# EAGLE board aq_mx_v1-6-0a (EAGLE 9.6.2)
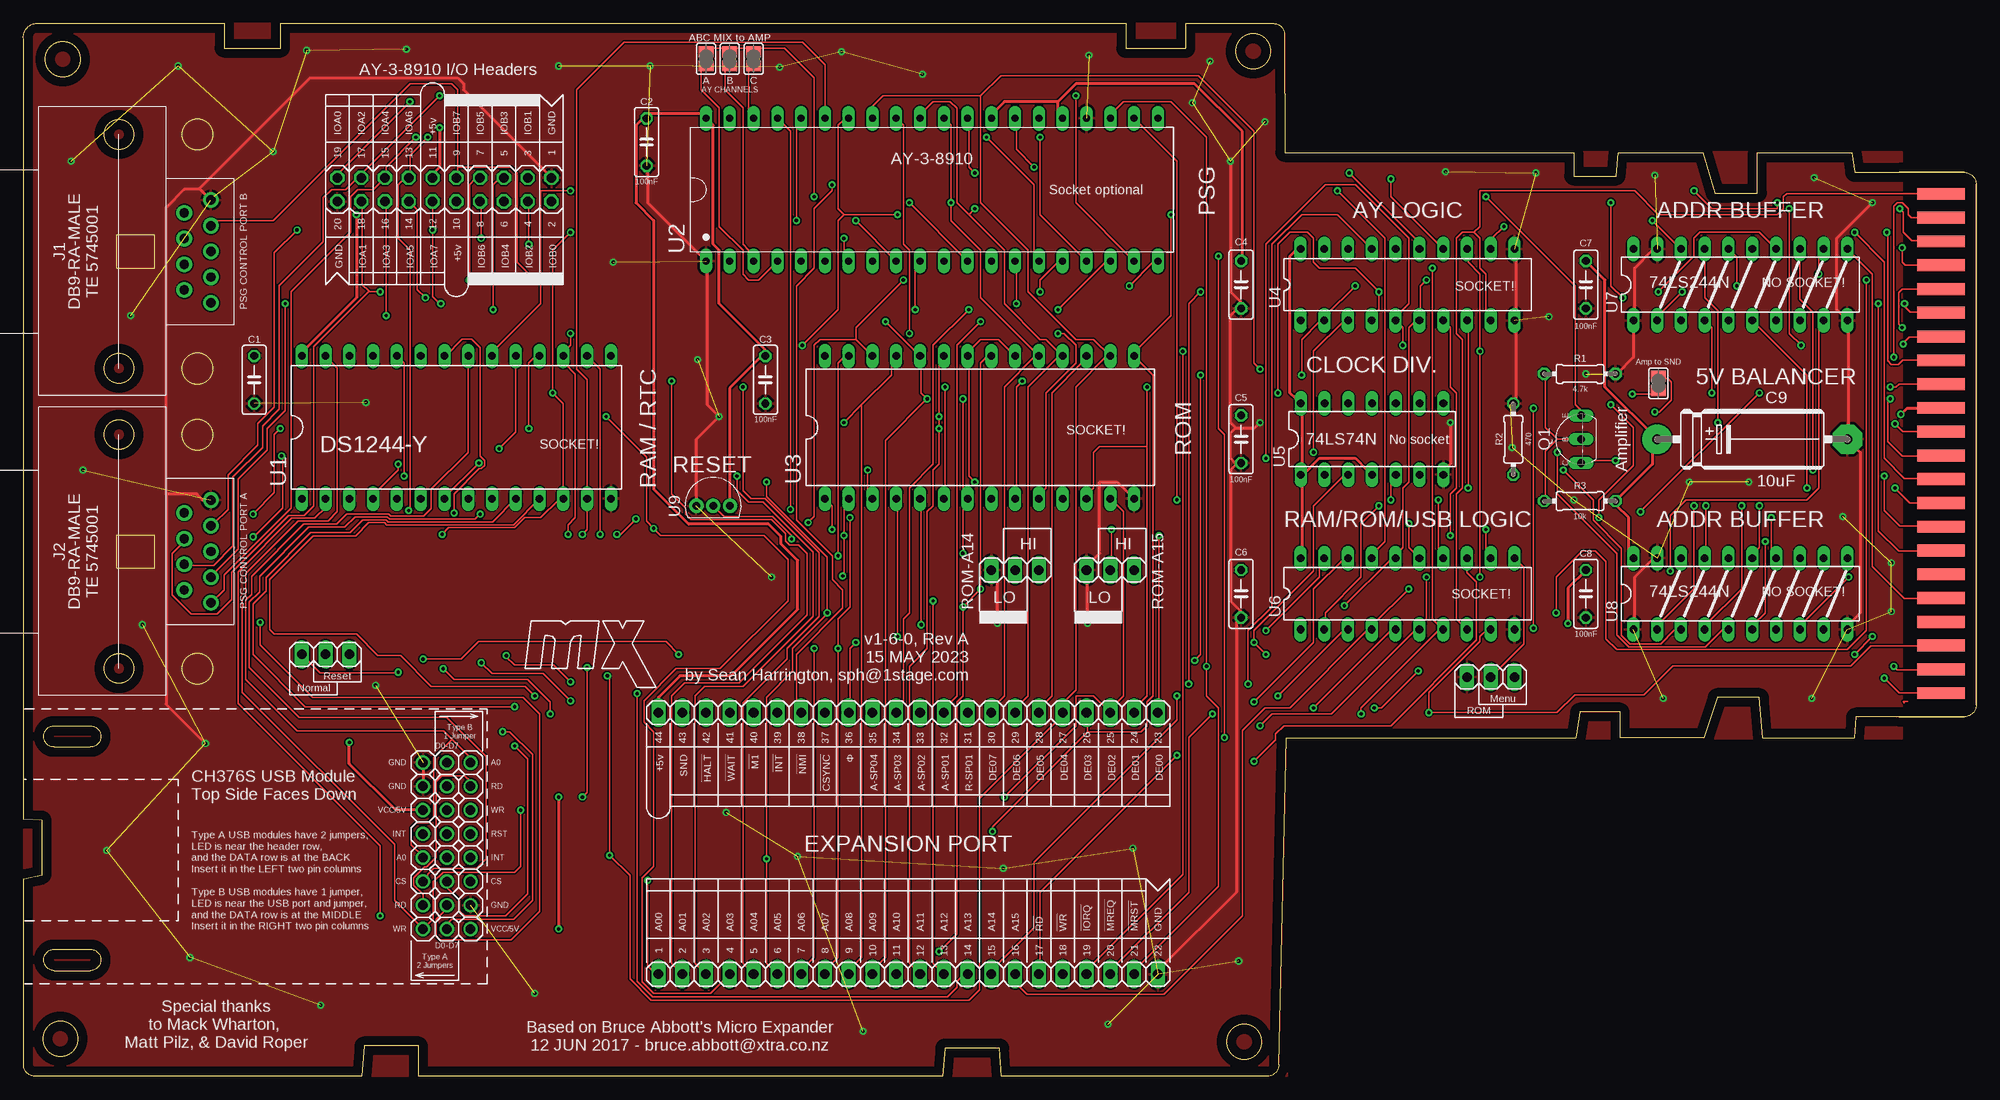
[diagram p1: board, top side]
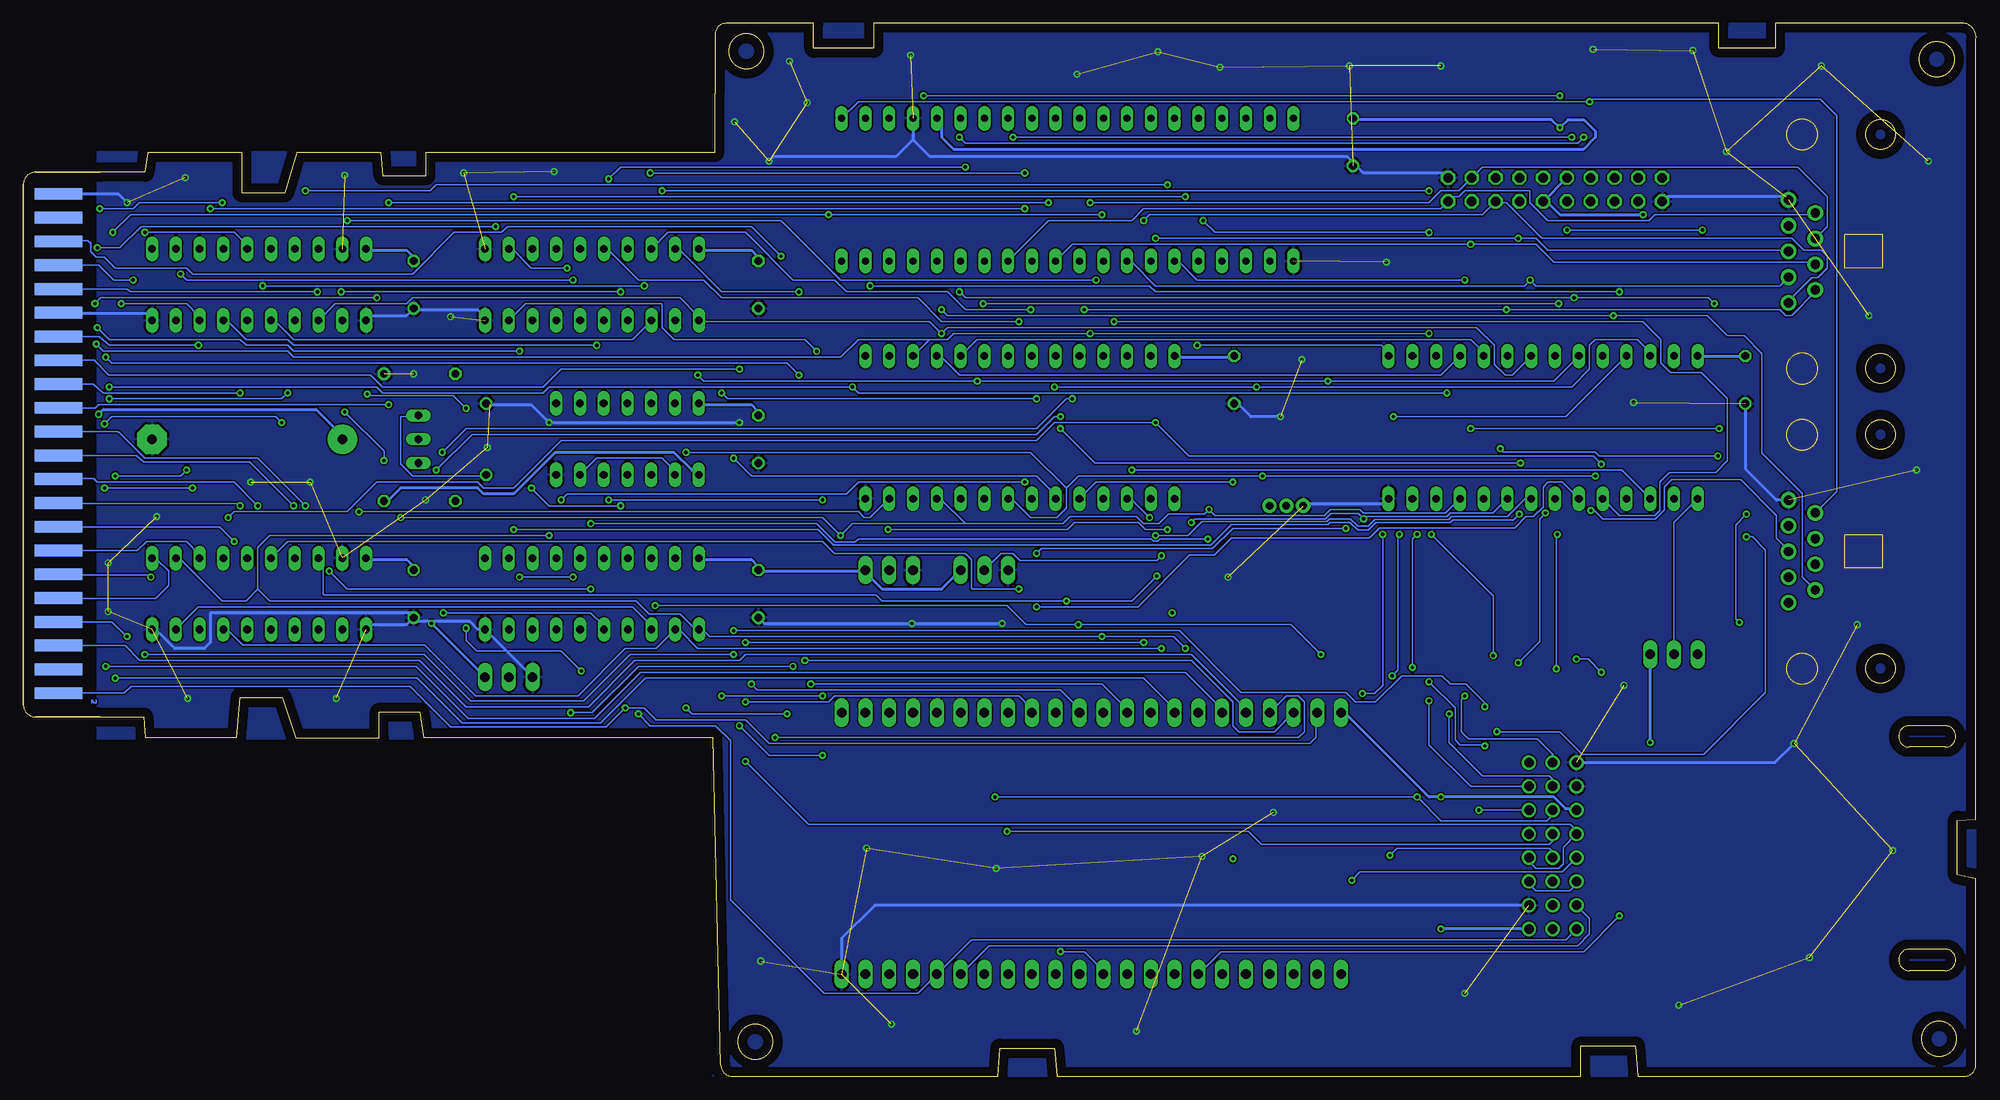
[diagram p2: board, bottom side, seen from below]

Size 208.57 x 112.5 mm. Coordinates in mm from the lower left corner, seen from the top.
Outline: 195.31,98.7 195.59,96.6 207.3,96.6 arc-90 208.57,95.33 208.57,39.67 arc-90 207.3,38.41 195.72,38.41 195.57,36.14 185.81,36.14 185.43,40.49 180.91,40.49 179.51,36.14 170.55,36.14 170.55,38.91 166.23,38.91 165.82,36.14 134.91,36.14 134.1,1.27 arc-90 132.83,0 104.46,0 104.28,3.02 98.44,3.02 98.16,0 42.2,0 42.2,3.25 36.38,3.25 36.13,0 1.28,0 arc-90 0.01,1.27 0.01,21.13 1.99,21.54 1.99,27.36 0.01,27.48 0.01,110.85 arc-90 1.28,112.5 21.42,112.5 21.42,109.86 27.47,109.86 27.47,112.5 117.77,112.5 117.77,109.83 124.17,109.83 124.17,112.5 133.44,112.5 arc-90 134.71,111.35 134.73,98.7 165.59,98.7 165.59,96.19 170.14,96.19 170.37,98.7 179.39,98.7 180.68,94.39 185.23,94.39 185.23,98.7 195.31,98.7
Outline: 3.31,35.18 7.12,35.18 arc180 7.12,37.47 3.31,37.47 arc180 3.31,35.18
Outline: 3.31,11.3 7.12,11.3 arc180 7.12,13.59 3.31,13.59 arc180 3.31,11.3
Outline: circle at 3.95,4.01 radius 1.86
Outline: circle at 4.2,108.66 radius 1.86
Outline: circle at 131.35,109.52 radius 1.86
Outline: circle at 130.39,3.71 radius 1.86
Outline: circle at 10.2,100.63 radius 1.57
Outline: circle at 10.2,75.64 radius 1.57
Outline: circle at 10.2,68.58 radius 1.57
Outline: circle at 10.2,43.59 radius 1.57
Copper layers (1*16): Top 0.035mm / dielectric 1.5mm / Bottom 0.035mm
Design rules "default": minimum track width 6mil, minimum drill 0.35mm, track to track 6mil, track to pad 6mil, pad to pad 6mil, via to via 6mil, smd to smd 6mil, copper to edge 40mil, drill to drill 6mil, minimum pad ring 10mil, minimum via ring 8mil, stop-mask expansion 4mil, vias tented up to drill 0mil, thermal gap 10mil
Net classes: 1 Power: width 0.305 mm, drill 0.102 mm, clearance 0.076 mm
tKeepout: area 26.7,45.7 to 79,58.4; area 202.7,38.1 to 208.3,96.5
bKeepout: area 202.7,38.1 to 208.3,96.5
Milling: area 16.9,99 to 20.2,102.3; area 16.9,74 to 20.2,77.3; area 16.9,66.9 to 20.2,70.2; area 16.9,41.9 to 20.2,45.2

## Footprints (pad centres in the part's own frame; a part is rotated, then mirrored left to right if it is on the bottom)
C050-025X075 = drill 0.813 octagon: 1 -2.54,0; 2 2.54,0
E22-6 = drill 1.016 pad 3.15: + -11.43,0 | drill 1.016 pad 3.15 octagon: - 8.89,0
DB9-MALE-RA = drill 1 pad 1.676: P$1 5.537,-9.83; P$2 2.794,-9.83; P$3 0.051,-9.83; P$4 -2.692,-9.83; P$5 -5.436,-9.83; P$6 4.166,-6.985; P$7 1.422,-6.985; P$8 -1.321,-6.985; P$9 -4.064,-6.985
1X03 = drill 1.016 long: 1 -2.54,0; 2 0,0; 3 2.54,0
2X10 = drill 1.016 octagon: 1 -11.43,-1.27; 2 -11.43,1.27; 3 -8.89,-1.27; 4 -8.89,1.27; 5 -6.35,-1.27; 6 -6.35,1.27; 7 -3.81,-1.27; 8 -3.81,1.27; 9 -1.27,-1.27; 10 -1.27,1.27; 11 1.27,-1.27; 12 1.27,1.27; 13 3.81,-1.27; 14 3.81,1.27; 15 6.35,-1.27; 16 6.35,1.27; 17 8.89,-1.27; 18 8.89,1.27; 19 11.43,-1.27; 20 11.43,1.27
1X22 = drill 1.016 long: 1 -26.67,0; 2 -24.13,0; 3 -21.59,0; 4 -19.05,0; 5 -16.51,0; 6 -13.97,0; 7 -11.43,0; 8 -8.89,0; 9 -6.35,0; 10 -3.81,0; 11 -1.27,0; 12 1.27,0; 13 3.81,0; 14 6.35,0; 15 8.89,0; 16 11.43,0; 17 13.97,0; 18 16.51,0; 19 19.05,0; 20 21.59,0; 21 24.13,0; 22 26.67,0
1X08 = drill 1.016: 1 -8.89,0; 2 -6.35,0; 3 -3.81,0; 4 -1.27,0; 5 1.27,0; 6 3.81,0; 7 6.35,0; 8 8.89,0
TO92-CBE = drill 0.813 long: B 0,0; C -2.54,0; E 2.54,0
0204/7 = drill 0.813 octagon: 1 -3.81,0; 2 3.81,0
SJ = smd 1.168 x 1.6: 1 -0.762,0; 2 0.762,0
DIL28-6 = drill 0.813 long: 1 -16.51,-7.62; 2 -13.97,-7.62; 3 -11.43,-7.62; 4 -8.89,-7.62; 5 -6.35,-7.62; 6 -3.81,-7.62; 7 -1.27,-7.62; 8 1.27,-7.62; 9 3.81,-7.62; 10 6.35,-7.62; 11 8.89,-7.62; 12 11.43,-7.62; 13 13.97,-7.62; 14 16.51,-7.62; 15 16.51,7.62; 16 13.97,7.62; 17 11.43,7.62; 18 8.89,7.62; 19 6.35,7.62; 20 3.81,7.62; 21 1.27,7.62; 22 -1.27,7.62; 23 -3.81,7.62; 24 -6.35,7.62; 25 -8.89,7.62; 26 -11.43,7.62; 27 -13.97,7.62; 28 -16.51,7.62
RAD38910-DIL40-6 = drill 0.743 pad 1.343 long: 1 -7.62,24.13; 2 -7.62,21.59; 3 -7.62,19.05; 4 -7.62,16.51; 5 -7.62,13.97; 6 -7.62,11.43; 7 -7.62,8.89; 8 -7.62,6.35; 9 -7.62,3.81; 10 -7.62,1.27; 11 -7.62,-1.27; 12 -7.62,-3.81; 13 -7.62,-6.35; 14 -7.62,-8.89; 15 -7.62,-11.43; 16 -7.62,-13.97; 17 -7.62,-16.51; 18 -7.62,-19.05; 19 -7.62,-21.59; 20 -7.62,-24.13; 21 7.62,-24.13; 22 7.62,-21.59; 23 7.62,-19.05; 24 7.62,-16.51; 25 7.62,-13.97; 26 7.62,-11.43; 27 7.62,-8.89; 28 7.62,-6.35; 29 7.62,-3.81; 30 7.62,-1.27; 31 7.62,1.27; 32 7.62,3.81; 33 7.62,6.35; 34 7.62,8.89; 35 7.62,11.43; 36 7.62,13.97; 37 7.62,16.51; 38 7.62,19.05; 39 7.62,21.59; 40 7.62,24.13
DIL20 = drill 0.813 long: 1 -11.43,-3.81; 2 -8.89,-3.81; 3 -6.35,-3.81; 4 -3.81,-3.81; 5 -1.27,-3.81; 6 1.27,-3.81; 7 3.81,-3.81; 8 6.35,-3.81; 9 8.89,-3.81; 10 11.43,-3.81; 11 11.43,3.81; 12 8.89,3.81; 13 6.35,3.81; 14 3.81,3.81; 15 1.27,3.81; 16 -1.27,3.81; 17 -3.81,3.81; 18 -6.35,3.81; 19 -8.89,3.81; 20 -11.43,3.81
DIL14 = drill 0.813 long: 1 -7.62,-3.81; 2 -5.08,-3.81; 3 -2.54,-3.81; 4 0,-3.81; 5 2.54,-3.81; 6 5.08,-3.81; 7 7.62,-3.81; 8 7.62,3.81; 9 5.08,3.81; 10 2.54,3.81; 11 0,3.81; 12 -2.54,3.81; 13 -5.08,3.81; 14 -7.62,3.81
TO-92 = drill 0.81 pad 1.51: 1 0,-1.8; 2 0,0; 3 0,1.8
AQ-CART-EDGE = smd 5.08 x 1.27: P$1 -1.905,-26.67; P$3 -1.905,-24.13; P$5 -1.905,-21.59; P$7 -1.905,-19.05; P$9 -1.905,-16.51; P$11 -1.905,-13.97; P$13 -1.905,-11.43; P$15 -1.905,-8.89; P$17 -1.905,-6.35; P$19 -1.905,-3.81; P$21 -1.905,-1.27; P$23 -1.905,1.27; P$25 -1.905,3.81; P$27 -1.905,6.35; P$29 -1.905,8.89; P$31 -1.905,11.43; P$33 -1.905,13.97; P$35 -1.905,16.51; P$37 -1.905,19.05; P$39 -1.905,21.59; P$41 -1.905,24.13; P$43 -1.905,26.67 | smd 5.08 x 1.27 bottom: P$2 -1.905,-26.67; P$4 -1.905,-24.13; P$6 -1.905,-21.59; P$8 -1.905,-19.05; P$10 -1.905,-16.51; P$12 -1.905,-13.97; P$14 -1.905,-11.43; P$16 -1.905,-8.89; P$18 -1.905,-6.35; P$20 -1.905,-3.81; P$22 -1.905,-1.27; P$24 -1.905,1.27; P$26 -1.905,3.81; P$28 -1.905,6.35; P$30 -1.905,8.89; P$32 -1.905,11.43; P$34 -1.905,13.97; P$36 -1.905,16.51; P$38 -1.905,19.05; P$40 -1.905,21.59; P$42 -1.905,24.13; P$44 -1.905,26.67

## Placement (x,y rotation side)
C1  100nF  [C050-025X075]  24.65,74.42 90 top
C2  100nF  [C050-025X075]  66.56,99.82 270 top
C3  100nF  [C050-025X075]  79.26,74.42 90 top
C4  100nF  [C050-025X075]  130.06,84.58 90 top
C5  100nF  [C050-025X075]  130.06,68.07 90 top
C6  100nF  [C050-025X075]  130.06,51.56 90 top
C7  100nF  [C050-025X075]  166.89,84.58 90 top
C8  100nF  [C050-025X075]  166.89,51.56 90 top
C9  10uF  [E22-6]  185.94,68.07 0 top
J1  DB9-MALE-RA  [DB9-MALE-RA]  10.2,88.09 90 top
J2  DB9-MALE-RA  [DB9-MALE-RA]  10.2,56.03 90 top
J3  RESET BEHV.  [1X03]  156.73,42.67 180 top
J4  [2X10]  44.97,94.74 180 top
J5  RTC Reset  [1X03]  32.27,45.09 180 top
J6  [1X22]  94.5,38.86 180 top
J7  [1X22]  94.5,10.92 0 top
J8  [1X03]  105.93,54.1 0 top
J9  [1X03]  116.09,54.1 0 top
JP1  [1X08]  42.68,24.64 270 top
JP2  [1X08]  45.22,24.64 270 top
JP3  [1X08]  47.76,24.64 270 top
LOGO  [AQUARIUS-LOGO-SMALL]  26.68,48.26 0 top
Q1  BC548  [TO92-CBE]  166.38,68.07 90 top
R1  4.7k  [0204/7]  166.25,75.06 0 top
R2  470  [0204/7]  159.14,68.07 90 top
R3  10k  [0204/7]  166.25,61.47 0 top
SJ1  [SJ]  72.91,108.71 90 top
SJ2  [SJ]  75.45,108.71 90 top
SJ3  [SJ]  77.99,108.71 90 top
SJ4  [SJ]  174.64,74.04 90 top
U1  CY62256LL-PC  [DIL28-6]  46.24,69.34 0 top
U2  AY-3-8910  [RAD38910-DIL40-6]  97.04,94.74 90 top
U3  27C512AP  [DIL28-6]  102.12,69.34 0 top
U4  GAL16V8  [DIL20]  147.84,84.58 0 top
U5  74LS74N  [DIL14]  144.05,68.1 0 top
U6  GAL16V8  [DIL20]  147.84,51.56 0 top
U7  74LS244N  [DIL20]  183.4,84.58 0 top
U8  74LS244N  [DIL20]  183.4,51.56 0 top
U9  DS1233  [TO-92]  73.67,60.96 270 top
XC1  AQ-CART-EDGE  [AQ-CART-EDGE]  206.74,67.61 0 top

## Tracks (layer width: path | path; a pad name or v marks a point on that pad's centre or on a via)
1-BC1  (via drill 0.35)
  Top 0.152: v141.62,96.52 148.6,89.53 148.6,88.9 U4.15 | v101.61,96.52 100.98,97.16 100.98,102.23 U2.29
  Bottom 0.152: v101.61,96.52 v141.62,96.52
1-IOA0  (via drill 0.35)
  Top 0.152: v41.29,104.14 33.67,96.52 J4.19
  Bottom 0.152: U2.21 119.39,104.14 v41.29,104.14 41.03,104.39 16.65,104.39 14.87,102.62 14.87,62.51 J2.P$6
1-IOA1  (via drill 0.35)
  Top 0.152: v118.12,84.45 120.66,87 U2.20 | 36.91,83.88 36.21,84.58 36.21,93.34 J4.18 | v38.11,83.82 36.97,83.82 36.91,83.88 | 36.91,83.88 31,77.98 31,60.96 29.98,59.94 28.33,59.94 22.24,53.85 22.24,50.93 20.71,49.4 17.92,49.4 15.89,51.44 15.89,55.88 17.16,57.15 J2.P$7
  Bottom 0.152: v118.12,84.45 88.28,84.45 87.64,83.82 v38.11,83.82
1-IOA2  (via drill 0.35)
  Top 0.152: U2.19 112.41,93.34 v112.41,104.78 | v44.46,104.78 36.21,96.52 J4.17 35.57,95.89 34.43,94.74 32.9,94.74 32.04,93.88 32.04,89.18 27.34,84.48 27.34,71.28 25.54,69.47 25.54,67.18 22.36,64.01 22.36,56.64 20.33,54.61 17.79,54.61 J2.P$8
  Bottom 0.152: v44.46,104.78 v112.41,104.78
1-IOA3  (via drill 0.35)
  Top 0.152: v110.5,81.92 115.58,87 U2.18 | v38.75,81.28 38.75,93.34 J4.16
  Bottom 0.152: v110.5,81.92 109.87,81.28 v38.75,81.28 28.71,81.28 26.55,79.12 24.78,79.12 22.9,77.24 22.9,66.57 18.58,62.26 18.58,53.37 J2.P$9
1-IOA4  (via drill 0.35)
  Top 0.152: U2.17 108.6,92.08 v108.6,100.33 | v41.92,100.33 38.75,97.16 38.75,96.52 J4.15 37.35,94.74 35.7,94.74 34.94,93.98 34.94,90.17 28.59,83.82 28.59,60.71 21.42,53.54 21.42,51.99 J2.P$5
  Bottom 0.152: v108.6,100.33 107.96,99.69 42.56,99.69 v41.92,100.33
1-IOA5  (via drill 0.35)
  Top 0.152: v108.6,83.82 108.6,85.09 110.5,87 U2.16 | v42.94,83.19 42.05,84.07 42.05,92.58 J4.14 | J2.P$4 20.03,53.42 22.94,56.33 22.94,63.82 26.05,66.93 26.05,69.22 27.95,71.12 v27.95,82.55
  Bottom 0.152: v108.6,83.82 107.96,83.19 v42.94,83.19 28.59,83.19 v27.95,82.55
1-IOA6  (via drill 0.35)
  Top 0.152: v102.88,100.33 107.96,95.25 107.96,87.63 U2.15 | v43.19,100.33 41.29,98.42 41.29,96.52 J4.13 40.65,95.89 40.02,95.25 40.02,89.53 41.29,88.27 41.29,60.58 v41.16,60.45
  Bottom 0.152: v43.19,100.33 v102.88,100.33 | v41.16,60.45 40.78,60.45 39.89,59.56 34.25,59.56 33.29,60.53 33.29,62.99 32.52,63.75 25.16,63.75 21.35,59.94 21.35,57.53 20.33,56.52 J2.P$3
1-IOA7  (via drill 0.35)
  Top 0.152: v106.06,82.55 106.06,87 U2.14 | v44.59,82.55 44.46,82.55 43.7,83.31 v43.7,90.42 J4.12 | J2.P$2 20.33,59.05 21.86,60.58 21.86,64.26 25.03,67.44 25.03,69.72 26.81,71.5 26.81,88.01 v29.22,90.42
  Bottom 0.152: v44.59,82.55 v106.06,82.55 | v43.7,90.42 v29.22,90.42
1-IOB0
  Bottom 0.152: U2.13 99.07,91.44 90.18,91.44 88.91,92.71 57.16,92.71 J4.2 55.89,93.98 55.26,93.98 54.62,94.61 47.64,94.61 47.64,93.34 45.73,91.44 34.94,91.44 34.3,92.08 17.79,92.08 J1.P$6
1-IOB1  (via drill 0.35)
  Top 0.152: v94.63,93.34 U2.12
  Bottom 0.152: v94.63,93.34 58.43,93.34 57.16,94.61 55.26,94.61 J4.3 52.72,97.16 19.06,97.16 15.89,93.98 15.89,90.81 J1.P$7
1-IOB2  (via drill 0.35)
  Top 0.152: v53.99,88.9 53.99,93.34 J4.4
  Bottom 0.152: U2.11 96.53,88.9 v53.99,88.9 47,88.9 45.1,87 17.79,87 J1.P$8
1-IOB3  (via drill 0.35)
  Top 0.152: v95.26,81.92 95.26,87 U2.10 | v50.18,81.92 50.18,95.25 50.81,95.89 J4.5
  Bottom 0.152: v95.26,81.92 v50.18,81.92 20.97,81.92 20.33,81.28 19.7,81.28 17.16,83.82 J1.P$9
1-IOB4  (via drill 0.35)
  Top 0.152: v88.91,91.44 U2.9
  Bottom 0.152: v88.91,91.44 88.28,92.08 52.72,92.08 J4.6 50.81,93.34 50.18,93.34 46.37,89.53 19.7,89.53 18.43,88.27 16.54,88.27 15.89,87.61 15.89,86.36 16.9,85.34 17.54,85.34 19.7,83.19 J1.P$5
1-IOB5  (via drill 0.35)
  Top 0.152: v47.64,85.09 47.64,95.25 48.27,95.89 J4.7
  Bottom 0.152: J1.P$4 20.97,84.45 47,84.45 v47.64,85.09 48.27,84.45 87.64,84.45 90.18,87 U2.8
1-IOB6  (via drill 0.35)
  Top 0.152: v87.64,89.53 87.64,87.63 U2.7 | v48.91,89.53 48.91,93.34 J4.8
  Bottom 0.152: v87.64,89.53 v48.91,89.53 47,89.53 45.73,88.27 20.33,88.27 J1.P$3
1-IOB7  (via drill 0.35)
  Top 0.152: v54.62,85.09 52.72,87 52.72,96.52 52.08,97.16 46.37,97.16 | 46.37,97.16 46.37,96.52 J4.9 | J1.P$2 20.33,91.44 26.68,91.44 41.29,106.05 45.73,106.05 46.37,105.41 46.37,97.16
  Bottom 0.152: v54.62,85.09 83.2,85.09 85.1,87 U2.6
!CH376  (via drill 0.35)
  Top 0.152: v156.22,58.42 156.22,55.88 U6.12 | JP1.6 43.19,20.95 43.19,21.59 43.83,22.23 48.4,22.23 49.41,23.24 49.41,34.16 45.22,38.35 29.48,38.35 24.14,43.69 24.14,50.67 25.22,51.75 25.22,53.4 30.49,58.67 34.32,58.67 35.42,59.77 38.87,59.77 39.1,59.54 48.25,59.54 v48.78,60.07
  Bottom 0.152: v156.22,58.42 123.71,58.42 122.06,56.77 81.7,56.77 79.52,58.95 69.23,58.95 69,59.18 66.86,59.18 66.05,58.37 64.91,58.37 64.1,59.18 56.15,59.18 55.89,59.44 49.41,59.44 v48.78,60.07 | 42.56,20.95 JP1.6 42.68,20.57 43.42,19.84 47.03,19.84 47.76,20.57 JP3.6
!CSYNC  (via drill 0.35)
  Top 0.152: v198.77,42.55 200.37,40.95 XC1.P$1
  Bottom 0.152: v198.77,42.55 166.51,42.55 161.71,37.75 146.92,37.75 142.12,42.55 88.91,42.55 85.74,39.37 J6.15
!HALT  (via drill 0.35)
  Top 0.152: v125.11,44.45 125.74,45.09 v125.74,74.93 | v199.78,76.83 199.78,92.96 200.16,93.34 200.66,93.34 201.31,92.7 201.31,92.08 201.64,91.75 XC1.P$41
  Bottom 0.152: J6.20 74.94,36.83 78.75,36.83 79.39,37.47 79.39,40.01 83.83,44.45 v125.11,44.45 | v125.74,74.93 127.01,76.2 199.15,76.2 v199.78,76.83
!INT  (via drill 0.35)
  Top 0.152: XC1.P$3 204.79,43.43 200.16,43.43 v199.78,43.81
  Bottom 0.152: v199.78,43.81 166.64,43.81 161.05,38.23 147.59,38.23 142.63,43.18 84.47,43.18 80.66,39.37 J6.17
!IORQ  (via drill 0.35)
  Top 0.152: U6.8 153.05,48.9 153.05,62.23 153.68,62.87 153.68,78.74 153.05,79.38 153.05,89.53 153.68,90.17 154.95,90.17 | U4.9 156.22,81.28 156.22,85.72 155.59,86.36 155.59,89.28 155.59,89.53 154.95,90.17 | v123.84,77.47 123.84,21.59 113.68,11.43 J7.19 | XC1.P$43 188.33,94.28 187.97,93.98 187.97,92.71 187.34,92.08 174.64,92.08 172.1,94.61 155.59,94.61 155.59,90.81 154.95,90.17
  Bottom 0.152: v123.84,77.47 125.11,78.74 139.08,78.74 140.35,80.01 140.35,82.55 154.95,82.55 U4.9
!M1
  Bottom 0.152: J6.18 78.12,39.37 83.83,45.09 131.46,45.09 132.09,44.45 143.27,44.45 148.22,39.5 161.3,39.5 166.25,44.45 196.14,44.45 197.72,46.02 XC1.P$6
!MREQ  (via drill 0.35)
  Top 0.152: v137.81,39.37 146.06,47.62 U6.5 | v127.01,38.73 124.47,36.2 124.47,19.68 116.22,11.43 J7.20 | v196.86,85.09 196.86,47.62 194.83,45.59 170.19,45.59 169.05,46.74 169.05,54.99 167.91,56.13 166.51,56.13 163.71,53.34 v163.71,49.53
  Bottom 0.152: v137.81,39.37 137.17,38.73 v127.01,38.73 | v196.86,85.09 198.94,85.09 200.51,86.67 XC1.P$38 | v163.71,49.53 147.97,49.53 146.7,48.26 U6.5
!MRST  (via drill 0.35)
  Top 0.152: U6.9 156.35,47.75 155.59,46.99 155.59,46.48 150.13,41.02 v150.13,38.86 163.8,38.86 165.7,40.77 173.1,40.77 176.16,43.83 195.19,43.83 197.34,45.97 204.78,45.97 XC1.P$5 | U2.23 116.22,102.87 117.49,104.14 122.57,104.14 126.38,100.33 v126.38,43.81 126.38,40.64 127.65,39.37 127.65,20.32 118.76,11.43 J7.21
  Bottom 0.152: v126.38,43.81 142.89,43.81 147.84,38.86 v150.13,38.86
!NMI  (via drill 0.35)
  Top 0.152: v86.37,95.25 86.37,94.61 84.47,92.71 84.47,86.36 82.56,84.45 82.56,59.44 86.4,55.6 86.4,53.09 87.51,51.97 87.51,50.04 82.56,45.09 82.56,39.37 J6.16 | v178.45,94.61 180.35,92.71 187.34,92.71 v187.34,93.34 | v200.42,92.71 200.8,92.33 200.8,90.17 201.69,89.28 204.76,89.28 XC1.P$39
  Bottom 0.152: v86.37,95.25 164.48,95.25 165.11,94.61 v178.45,94.61 | v187.34,93.34 196.23,93.34 196.86,92.71 v200.42,92.71
!PRST  (via drill 0.35)
  Top 0.152: U6.13 154.19,53.85 155.21,52.83 155.21,46.61 146.06,37.47 134.63,37.47 133.74,36.58 133.74,35.94 v131.46,33.66
  Bottom 0.152: v131.46,33.66 124.73,26.92 43.32,26.92 42.68,26.29 JP1.4 44.11,24.49 44.11,22.7 44.56,22.25 47.03,22.25 47.76,22.98 JP3.5
!RD  (via drill 0.35)
  Top 0.152: v149.87,53.34 149.87,48.9 149.24,48.26 U6.6 148.6,47.62 139.71,38.73 133.36,38.73 v132.09,37.47 | v155.59,53.34 v155.59,77.47 155.59,85.72 154.32,87 154.32,88.27 U4.13 | XC1.P$35 200.67,84.12 200.29,83.74 200.29,80.39 v200.67,80.01 | v123.2,34.29 108.6,19.68 108.6,11.43 J7.17 | JP1.7 42.68,19.43 41.69,20.42 41.69,21.24 42.83,22.38 43.09,22.38 44.11,23.39 44.11,31.52 44.69,32.11 47.15,32.11 47.76,31.5 JP3.2 | U1.22 45.08,76.96 46.89,78.77 47.88,78.77 48.78,77.86 48.78,66.26 49.26,65.78 49.26,65.28 48.9,64.92 48.68,64.92 45.99,62.23 v45.99,60.2 | v58.43,40.13 55.51,43.05 50.05,43.05 v48.91,44.2
  Bottom 0.152: v155.59,53.34 v149.87,53.34 | v200.67,80.01 199.4,78.74 185.43,78.74 184.8,78.11 180.35,78.11 179.72,77.47 v155.59,77.47 | J7.17 105.42,13.97 42.56,13.97 41.29,15.24 41.29,16.89 JP1.7 | v132.09,37.47 128.92,34.29 v123.2,34.29 | JP3.2 53.99,30.99 58.43,35.43 v58.43,40.13 | v48.91,44.2 46.62,46.48 46.62,59.56 v45.99,60.2
!WAIT  (via drill 0.35)
  Top 0.152: v128.28,36.2 128.28,68.58 127.65,69.22 v127.65,87.63
  Bottom 0.152: J6.19 73.67,40.64 72.4,40.64 71.77,40.01 71.77,36.83 72.4,36.2 v128.28,36.2 | v127.65,87.63 130.82,90.81 156.86,90.81 157.49,90.17 162.57,90.17 167.02,85.72 190.51,85.72 191.15,86.36 198.77,86.36 199.94,87.53 200.8,87.53 201.41,88.14 201.41,89 201.69,89.28 204.76,89.28 XC1.P$40
!WR  (via drill 0.35)
  Top 0.152: v150.51,86.36 150.51,48.9 U6.7 151.14,47.62 142.89,39.37 v142.89,38.73 | v200.67,88.52 200.67,87 201.03,86.67 XC1.P$37 | v158.13,90.81 156.86,89.53 156.86,88.9 U4.12 | U1.27 33.54,75.69 33.54,60.33 32.55,59.33 29.35,59.33 23.74,53.72 23.74,51.36 23.38,51 23.38,41.02 39.64,24.77 39.64,18.8 JP1.8 43.78,16.84 43.78,20.78 44.81,21.82 52.49,21.82 53.1,22.43 v53.1,28.45
  Bottom 0.152: v150.51,86.36 154.32,86.36 156.22,88.27 U4.12 | v200.67,88.52 198.26,88.52 195.97,90.81 v158.13,90.81 | JP1.8 43.83,14.61 107.33,14.61 J7.18 113.04,8.89 123.07,8.89 133.04,18.86 133.04,35.88 134.63,37.47 141.62,37.47 v142.89,38.73 | v53.1,28.45 JP3.3
A
  Top 0.152: U2.4 78.5,85.09 77.48,85.09 76.85,85.72 76.85,88.27 74.31,90.81 74.31,103.5 72.4,105.41 72.4,107.95 SJ1.1
A00  (via drill 0.35)
  Top 0.152: v110.5,79.38 111.14,79.38 112.41,78.11 112.41,76.2 109.23,73.03 109.23,62.87 108.6,62.23 U3.10 | U1.21 47.51,66.67 43.57,62.74 43.57,60.69 42.72,59.84 39.23,59.84 39,60.07 34.53,60.07 33.49,59.03 29.96,59.03 24.36,53.43 24.36,51.47 23.76,50.88 23.76,42.42 29.25,36.93 44.87,36.93 45.79,36.01 | J7.1 67.58,10.92 66.69,11.81 v66.69,20.95 | JP1.5 42.68,23.49 41.44,24.74 41.44,26.57 41.94,27.08 43.22,27.08 43.8,27.66 43.8,34.02 45.79,36.01 | JP3.1 47.76,34.04 45.79,36.01
  Bottom 0.152: U7.3 175.27,82.55 167.65,82.55 167.02,83.19 138.44,83.19 136.54,81.28 U4.1 135.9,80.64 111.77,80.64 v110.5,79.38 109.87,80.01 53.35,80.01 51.45,78.11 51.45,76.07 50.3,74.93 49.54,74.93 U1.21 | v66.69,20.95 65.8,21.84 44.21,21.84 JP1.5
A01  (via drill 0.35)
  Top 0.152: v106.69,74.3 106.06,73.66 106.06,62.23 U3.9 | v136.54,74.93 136.54,78.74 138.44,80.64 U4.2 139.08,81.28 v142.25,84.45 | U7.16 183.02,87.5 v183.02,84.45 | J7.2 69.23,12.06 69.23,40.64 70.62,42.04 76.47,42.04 83.7,49.28 83.7,55.88 82.82,56.77 81.83,56.77 81.42,57.18 81.42,57.99 79.9,59.51 71.31,59.51 70.75,60.07 70.75,60.71 69.23,62.23 v69.23,74.3
  Bottom 0.152: U1.23 45.1,74.3 v69.23,74.3 v106.69,74.3 135.9,74.3 v136.54,74.93 | v142.25,84.45 v183.02,84.45
A02  (via drill 0.35)
  Top 0.152: U1.24 40.65,76.2 v40.65,64.14 | J7.3 71.77,12.06 71.77,40.64 72.78,41.66 76.85,41.66 84.34,49.15 84.34,56.01 78.98,61.37 77.46,61.37 76.21,62.61 v76.21,64.14 | v137.81,66.67 137.81,77.47 140.98,80.64 U4.3
  Bottom 0.152: U4.3 143.52,78.74 179.72,78.74 181.62,80.64 U7.5 | v40.65,64.14 v76.21,64.14 95.9,64.14 97.17,62.87 | 97.17,62.87 97.17,60.71 98.18,59.69 100.98,59.69 102.88,61.59 U3.8 | v137.81,66.67 100.98,66.67 97.17,62.87
A03  (via drill 0.35)
  Top 0.152: v174.64,83.82 178.45,87.63 178.45,89.53 179.08,90.17 185.43,90.17 U7.14 | U4.4 144.16,81.28 144.79,81.92 v144.79,83.82 142.25,86.36 138.44,86.36 137.81,87 137.81,89.53 137.17,90.17 135.27,90.17 134,88.9 v134,73.03 | v62.24,70.48 66.56,66.17 66.56,59.31 v67.32,58.55 68.08,57.78 79.13,57.78 81.67,55.24 81.67,50.8 74.43,43.56 69.73,43.56 66.31,40.13 66.31,37.85 67.32,36.83 67.32,22.45 66.08,21.21 66.08,10.13 67.32,8.89 73.42,8.89 J7.4 | v100.34,55.88 100.34,61.59 U3.7 100.34,62.23 v100.34,72.39
  Bottom 0.152: v174.64,83.82 v144.79,83.82 | U1.25 43.83,70.48 v62.24,70.48 | v100.34,55.88 99.83,56.39 81.55,56.39 79.39,58.55 v67.32,58.55 | v134,73.03 133.36,72.39 v100.34,72.39
A04  (via drill 0.35)
  Top 0.152: v147.33,78.11 147.33,80.01 U4.5 146.7,81.28 147.97,82.55 147.97,89.53 142.25,95.25 139.08,95.25 132.73,88.9 v132.73,66.04 | v98.44,73.66 98.44,62.23 U3.6 | J7.5 76.85,12.06 76.85,39.88 81.55,44.58 81.55,45.72 84.97,49.15 84.97,55.96 79.21,61.72 77.74,61.72 76.85,62.61 v76.85,73.66
  Bottom 0.152: v147.33,78.11 179.72,78.11 180.35,78.74 184.8,78.74 186.7,80.64 U7.7 | v98.44,73.66 v76.85,73.66 43.19,73.66 41.29,75.56 41.29,78.11 40.65,78.74 36.21,78.74 34.94,77.47 U1.26 | v132.73,66.04 130.82,64.14 100.34,64.14 98.44,62.23 U3.6
A05  (via drill 0.35)
  Top 0.152: v191.78,85.72 191.78,88.27 U7.12 | v149.87,85.09 149.24,84.45 149.24,81.28 U4.6 148.6,80.64 147.97,80.01 147.97,63.5 147.33,62.87 147.33,56.52 146.7,55.88 U6.16 146.06,55.24 v141.11,50.29 | J7.6 79.39,12.06 v79.39,23.24 79.39,40.51 82.18,43.31 82.18,45.72 85.86,49.4 v85.86,49.53 85.86,55.5 79.39,61.98 v79.39,63.5 | v95.9,48.26 95.9,61.59 U3.5 | J5.3 31.69,43.13 39.97,43.13 v40.02,43.18 | v69.99,45.09 68.62,46.45 48.62,46.45 46.75,44.58 v42.68,44.58
  Bottom 0.152: v191.78,85.72 191.15,85.09 v149.87,85.09 | v79.39,63.5 93.99,63.5 U3.5 | v141.11,50.29 103.52,50.29 101.48,48.26 v95.9,48.26 73.16,48.26 v69.99,45.09 | v40.02,43.18 41.41,44.58 v42.68,44.58
A06  (via drill 0.35)
  Top 0.152: v93.36,46.99 93.36,61.59 U3.4 | U4.7 152.41,80.01 152.41,73.66 153.05,73.03 153.05,62.87 152.41,62.23 v152.41,57.78 | v84.47,45.72 84.47,12.7 83.2,11.43 J7.7 | v38.11,17.14 38.11,24.64 22.92,39.83 22.92,53.9 28.66,59.64 31.13,59.64 32.27,60.78 U1.2
  Bottom 0.152: v38.11,17.14 41.92,13.34 80.66,13.34 J7.7 | U8.12 191.78,55.24 187.34,50.8 184.8,50.8 183.53,52.07 | v152.41,57.78 182.26,57.78 183.53,56.52 183.53,52.07 | v84.47,45.72 85.74,46.99 v93.36,46.99 135.27,46.99 135.9,47.62 U6.1 136.79,47.75 138.44,49.4 141.74,49.4 143.14,50.8 182.26,50.8 183.53,52.07
A07  (via drill 0.35)
  Top 0.152: v154.32,62.87 154.32,80.64 U4.8 | v144.79,60.96 142.89,59.05 142.89,53.34 139.08,49.53 139.08,48.26 U6.2 | v90.18,64.77 90.18,62.23 U3.3 | v88.28,59.69 88.28,50.16 87.01,48.9 v87.01,45.72 87.01,12.7 85.74,11.43 J7.8
  Bottom 0.152: U8.7 186.7,47.62 185.15,46.08 165.72,46.08 160.29,40.64 149.34,40.64 144.28,45.7 140.99,45.7 138.95,47.74 U6.2 138.44,47.62 136.54,45.72 v87.01,45.72 | v154.32,62.87 152.41,60.96 v144.79,60.96 | v88.28,59.69 90.18,61.59 U3.3 | U1.3 37.86,64.77 v90.18,64.77
A08  (via drill 0.35)
  Top 0.152: v40.02,65.41 40.02,64.77 37.48,62.23 U1.4 | 89.55,71.75 92.72,74.93 92.72,76.83 U3.25 | 89.55,71.75 v87.64,69.85 | v186.7,59.69 186.7,55.88 U8.14 | 89.55,71.75 89.55,12.7 88.28,11.43 J7.9
  Bottom 0.152: v40.02,65.41 40.91,66.29 84.09,66.29 v87.64,69.85 98.44,69.85 100.34,67.94 151.14,67.94 156.22,62.87 159.4,62.87 160.03,63.5 170.83,63.5 174,60.33 186.07,60.33 v186.7,59.69
A09  (via drill 0.35)
  Top 0.152: v92.09,80.64 U3.24 95.9,76.83 95.9,73.03 v96.53,72.39 92.09,67.94 92.09,12.7 90.82,11.43 J7.10 | U8.5 181.51,47.75 179.65,45.9 171.48,45.9 170.19,47.18 170.19,55.88 163.84,62.23 v163.84,66.67
  Bottom 0.152: U1.5 38.11,59.94 34.3,59.94 33.79,60.45 33.79,63.5 32.78,64.52 27.82,64.52 26.55,65.79 26.55,72.39 29.35,75.18 32.65,75.18 33.67,76.2 33.67,78.74 35.57,80.64 v92.09,80.64 | v163.84,66.67 161.3,69.22 100.34,69.22 97.17,72.39 v96.53,72.39
A10  (via drill 0.35)
  Top 0.152: U3.21 102.88,76.83 102.25,76.2 v102.25,52.07 v100.34,50.16 100.34,40.64 99.71,40.01 99.71,15.24 v97.8,13.34
  Bottom 0.152: v100.34,50.16 89.55,50.16 84.01,55.7 81.37,55.7 79.54,57.53 64.78,57.53 63.74,58.57 49.29,58.57 48.07,59.79 47.27,59.79 46.24,60.82 46.24,62.99 45.73,63.5 44.21,63.5 U1.6 | U8.16 180.35,57.15 123.2,57.15 121.93,55.88 107.96,55.88 107.33,55.24 107.33,52.07 v102.25,52.07 | v97.8,13.34 95.26,13.34 93.36,11.43 J7.11
A11  (via drill 0.35)
  Top 0.152: v48.65,65.53 45.01,61.89 U1.7 | U3.23 97.8,76.83 v97.8,70.48 v97.8,69.22 97.8,65.41 97.17,64.77 97.17,60.96 96.53,60.33 96.53,45.72 94.63,43.81 94.63,12.06 J7.12 | U8.3 176.54,47.62 176.3,47.62 174.88,46.2 171.6,46.2 170.7,47.1 170.7,56.42 167.68,59.44 167.68,61.57 v164.48,64.77
  Bottom 0.152: v97.8,69.22 94.12,65.53 v48.65,65.53 | v164.48,64.77 160.67,68.58 100.34,68.58 98.44,70.48 v97.8,70.48
A12  (via drill 0.35)
  Top 0.152: U3.2 87.64,61.59 v87.64,57.78 87.64,53.59 v87.51,53.47 | J7.13 97.17,12.06 v97.17,50.8
  Bottom 0.152: v87.51,53.47 90.18,50.8 v97.17,50.8 116.85,50.8 117.49,51.44 176.54,51.44 176.54,55.24 U8.18 | U1.8 48.13,61.72 50.06,59.79 56.04,59.79 56.32,59.51 64.2,59.51 64.91,58.8 66.05,58.8 66.81,59.56 69.05,59.56 69.35,59.26 82.69,59.26 84.16,57.78 v87.64,57.78
A13  (via drill 0.35)
  Top 0.152: v83.83,59.18 84.47,59.82 84.47,78.11 85.1,78.74 88.91,78.74 | 88.91,78.74 U3.26 | v174,91.44 U7.18 | v93.99,85.09 88.91,80.01 88.91,78.74 | v65.54,40.89 65.54,10.16 67.19,8.51 98.69,8.51 99.71,9.53 99.71,10.16 100.34,10.79 J7.14 | v65.42,59.56 63.77,57.91 v63.38,57.91
  Bottom 0.152: v83.83,59.18 83.45,59.56 69.48,59.56 68.92,60.12 65.98,60.12 v65.42,59.56 65.16,59.82 56.53,59.82 56.17,60.17 51.6,60.17 U1.9 | v174,91.44 127.65,91.44 121.3,85.09 v93.99,85.09 | v63.38,57.91 63.38,41.78 64.27,40.89 v65.54,40.89
A14  (via drill 0.35)
  Top 0.152: v123.2,40.64 123.2,38.1 107.96,22.86 107.96,15.88 103.52,11.43 J7.15 | v134,40.64 140.98,47.62 U6.3
  Bottom 0.152: U8.9 189.88,50.16 143.52,50.16 141.62,48.26 U6.3 | v134,40.64 v123.2,40.64
A15  (via drill 0.35)
  Top 0.152: J7.16 105.93,10.03 107.2,8.76 121.8,8.76 130.19,17.14 130.19,36.96 132.6,39.37 135.27,39.37 143.52,47.62 U6.4 144.16,48.26 v147.97,52.07 | U7.9 191.78,80.64 191.78,62.87 190.51,61.59 177.56,61.59 175.91,59.94 v175.91,53.98
  Bottom 0.152: v175.91,53.98 174,52.07 v147.97,52.07
A-SP01  (via drill 0.35)
  Top 0.152: v102.25,80.64 99.71,78.11 99.71,40.64 98.44,39.37 J6.10
  Bottom 0.152: v102.25,80.64 110.5,80.64 113.04,83.19 134,83.19 135.9,85.09 142.89,85.09 146.06,88.27 U4.16
A-SP02  (via drill 0.35)
  Top 0.152: U4.17 140.35,92.08 136.54,92.08 133.36,88.9 133.36,50.16 130.82,47.62 v130.82,41.91
  Bottom 0.152: v130.82,41.91 130.19,41.27 97.8,41.27 95.9,39.37 J6.11
A-SP03  (via drill 0.35)
  Top 0.152: v100.98,81.92 97.17,78.11 97.17,65.41 94.63,62.87 94.63,49.53 93.99,48.9 93.99,40.01 93.36,39.37 J6.12
  Bottom 0.152: U4.18 139.71,90.17 131.46,90.17 126.38,85.09 121.93,85.09 120.66,83.82 109.87,83.82 107.96,81.92 v100.98,81.92
A-SP04  (via drill 0.35)
  Top 0.152: v125.74,83.82 124.47,82.55 v124.47,41.91
  Bottom 0.152: v125.74,83.82 134,83.82 138.44,88.27 U4.19 | v124.47,41.91 93.36,41.91 90.82,39.37 J6.13
B
  Top 0.152: SJ2.1 74.94,107.95 74.94,105.41 76.85,103.5 76.85,88.9 77.48,88.27 77.48,87.63 U2.3
BDIR  (via drill 0.35)
  Top 0.152: U4.14 146.06,93.98 v146.06,95.89 | v107.96,97.16 106.06,99.06 106.06,102.23 U2.27
  Bottom 0.152: v146.06,95.89 144.79,97.16 v107.96,97.16
C
  Top 0.152: SJ3.1 77.48,107.95 77.48,102.87 U2.38
CHABC  (via drill 0.35)
  Top 0.152: SJ1.2 73.04,109.86 74.94,109.86 SJ2.2 75.58,109.86 77.48,109.86 SJ3.2 78.12,109.86 81.29,109.86 84.47,106.68 v84.47,93.98 | v156.22,93.98 165.75,84.45 165.75,71.75 166.38,71.12 Q1.E
  Bottom 0.152: R2.1 159.4,64.14 167.02,64.14 168.29,65.41 168.29,70.48 166.38,70.48 Q1.E | v156.22,93.98 v84.47,93.98
DE00  (via drill 0.35)
  Top 0.152: U2.37 81.93,100.97 v81.93,60.58 | v121.3,57.78 121.3,39.37 J6.1 | v168.29,59.69 168.29,61.59 171.97,65.28 171.97,69.34 v169.56,71.75 | U1.11 52.34,58.93 42.68,58.93 38.82,58.93 38.59,59.16 36.87,59.16 35.47,57.76 30.97,57.76 26.3,53.09 26.3,47.75 26.81,47.24 35.57,47.24 37.86,44.96 40.27,44.96 43.57,41.66 53.61,41.66 v54.62,40.64
  Bottom 0.152: 107.96,59.05 110.5,61.59 U3.11 | 107.96,59.05 120.03,59.05 v121.3,57.78 123.2,59.69 v168.29,59.69 | v169.56,71.75 200.54,71.75 200.9,71.42 XC1.P$26 | JP2.1 45.22,34.42 46.87,36.07 54.24,36.07 55,36.83 55,40.26 v54.62,40.64 | U1.11 56.68,60.17 65.42,60.17 65.82,60.58 68.97,60.58 69.61,59.94 81.29,59.94 v81.93,60.58 82.43,60.07 86.24,60.07 87.26,59.05 88.91,59.05 89.67,59.82 96.79,59.82 97.55,59.05 107.96,59.05
DE01  (via drill 0.35)
  Top 0.152: 120.03,67.31 114.95,67.31 114.31,66.67 114.31,62.87 113.68,62.23 U3.12 | 120.03,67.31 120.03,40.64 118.76,39.37 J6.2 | v199.4,73.66 200.02,73.66 200.37,73.97 XC1.P$27 | 120.03,67.31 v120.03,73.66 | 57.16,61.59 55.26,59.69 53.53,59.69 52.46,58.62 45.43,58.62 v44.72,57.91 | 57.16,61.59 57.67,62.1 57.67,71.88 v56.53,73.03 56.53,88.27 v58.43,90.17 | v56.27,38.73 56.27,40.01 53.86,42.42 45.99,42.42 v44.84,43.56 | 57.16,61.59 U1.12 | v82.56,91.44 82.56,102.23 U2.36
  Bottom 0.152: v199.4,73.66 170.83,73.66 170.19,73.03 153.05,73.03 152.41,73.66 v120.03,73.66 119.39,73.03 v56.53,73.03 | v82.56,91.44 81.29,90.17 v58.43,90.17 | v44.72,57.91 44.84,57.78 v44.84,43.56 | v56.27,38.73 56.3,38.7 56.3,35.67 52.73,32.1 45.57,32.1 45.22,31.75 JP2.2
DE02  (via drill 0.35)
  Top 0.152: U3.13 117.49,60.33 117.49,40.64 116.22,39.37 J6.3 114.31,40.64 112.41,40.64 112.41,37.47 v104.79,29.84 | v172.73,60.33 v185.43,73.03 | v60.21,43.69 60.21,30.35 v59.7,29.84 | v59.7,57.91 60.21,58.42 U1.13 60.21,74.42 59.07,75.56 59.07,105.41 64.15,110.49 83.2,110.49 85.61,108.08 U2.35
  Bottom 0.152: v185.43,73.03 200.04,73.03 201.13,73.97 XC1.P$28 | v172.73,60.33 119.39,60.33 118.76,59.69 118.12,59.69 U3.13 | v59.7,57.91 60.21,57.4 v60.21,43.69 | JP2.3 45.22,27.94 45.86,27.3 57.16,27.3 v59.7,29.84 v104.79,29.84
DE03  (via drill 0.35)
  Top 0.152: v83.2,78.11 87.01,81.92 87.01,91.44 87.64,92.08 | U2.34 87.64,102.23 87.01,101.6 87.01,92.71 87.64,92.08 | 113.68,36.83 119.39,36.83 120.03,37.47 120.03,40.01 120.66,40.64 120.66,74.93 U3.15 118.76,77.47 122.57,81.28 v122.57,92.08 | 113.68,36.83 113.68,38.73 J6.4 | v199.02,90.17 199.15,90.04 199.15,76.45 199.53,76.07 200.25,76.07 200.75,76.5 XC1.P$29 | v93.36,92.08 87.64,92.08 | 113.68,36.83 103.52,26.67 v103.52,26.16
  Bottom 0.152: JP2.4 45.22,25.15 45.6,24.77 67.32,24.77 71.77,24.77 76.34,24.77 77.74,26.16 v103.52,26.16 | v83.2,78.11 63.51,78.11 62.88,77.47 U1.15 | v199.02,90.17 197.12,92.08 v122.57,92.08 v93.36,92.08
DE04  (via drill 0.35)
  Top 0.152: U1.16 61.61,75.56 v61.61,57.91 | v62.37,42.8 62.62,42.55 v62.62,23.62 64.78,21.46 64.78,10.41 67.07,8.13 100.98,8.13 102.12,9.27 102.12,29.72 110.5,38.1 110.5,38.73 J6.5 111.14,39.37 111.14,40.01 112.41,41.27 112.41,73.66 115.58,76.83 U3.16 114.31,78.74 112.41,78.74 107.33,83.82 107.33,88.27 102.25,93.34 102.25,104.78 | U2.33 90.69,103.63 91.83,104.78 102.25,104.78 | v132.09,75.56 131.46,76.2 131.46,100.97 125.49,106.93 104.41,106.93 102.25,104.78
  Bottom 0.152: v61.61,57.91 61.73,57.78 61.73,43.43 v62.37,42.8 | v62.62,23.62 61.86,24.38 45.6,24.38 45.22,24 JP2.5 | v132.09,75.56 151.14,75.56 153.05,73.66 170.19,73.66 171.46,74.93 199.44,74.93 201.02,76.5 XC1.P$30
DE05  (via drill 0.35)
  Top 0.152: v52.46,35.31 53.86,33.91 53.86,19.49 51.51,17.14 47.13,17.14 46.62,17.65 46.62,18.8 45.22,20.19 JP2.6 | v58.43,79.38 58.43,78.11 57.8,77.47 U1.17 57.8,76.83 57.8,76.2 58.94,75.06 58.94,59.69 58.18,58.93 v58.18,57.91 | U2.32 93.99,101.6 93.99,88.9 94.63,88.27 v94.63,79.38 | J6.6 108.6,39.37 109.87,40.64 109.87,73.03 113.04,76.2 113.04,76.83 U3.17 | v200.8,78.23 200.8,78.36 201.43,78.99 204.78,78.99 XC1.P$31 | v51.57,44.96 51.57,44.83 52.46,43.94 56.65,43.94 v58.43,42.16
  Bottom 0.152: v58.43,79.38 v94.63,79.38 109.23,79.38 109.87,78.74 111.77,78.74 | U3.17 111.77,78.74 | v200.8,78.23 200.04,77.47 180.35,77.47 179.72,76.83 121.3,76.83 119.39,78.74 111.77,78.74 | v58.43,42.16 55.64,39.37 55.64,35.94 55.13,35.43 52.59,35.43 v52.46,35.31 | v58.18,57.91 51.57,51.31 v51.57,44.96
DE06  (via drill 0.35)
  Top 0.152: JP2.7 45.1,17.78 44.08,16.76 44.08,14.99 44.46,14.61 52.08,14.61 55.13,17.65 55.13,38.73 53.35,40.51 30.87,40.51 25.28,46.1 v25.28,48.51 | 100.98,92.08 104.79,88.27 104.79,82.55 108.6,78.74 109.23,78.74 U3.18 110.5,76.83 107.33,73.66 107.33,40.64 106.06,39.37 J6.7 | 100.98,92.08 99.71,93.34 99.71,103.42 98.98,104.14 97.17,104.14 95.9,102.87 U2.31 | v189.88,78.11 188.61,79.38 v188.61,92.71 | 100.98,92.08 v101.61,92.71 | v53.99,69.22 53.99,76.2 54.62,76.83 U1.18 | v27.44,69.22 26.81,68.58 26.81,62.36 v24.52,60.07
  Bottom 0.152: U1.18 57.16,74.93 108.6,74.93 110.5,76.83 U3.18 | v189.88,78.11 199.38,78.11 200.48,79.05 XC1.P$32 | v101.61,92.71 v188.61,92.71 | v53.99,69.22 v27.44,69.22 | v24.52,60.07 25.67,58.93 25.67,48.9 v25.28,48.51
DE07  (via drill 0.35)
  Top 0.152: U2.30 99.07,101.6 v99.07,93.34 99.07,91.44 102.25,88.27 102.25,83.19 U3.19 107.96,76.83 104.79,73.66 104.79,40.64 103.52,39.37 J6.8 | U1.19 52.59,68.83 v50.81,67.06 | JP2.8 45.22,16.26 45.73,16.76 52.34,16.76 54.37,18.8 54.37,34.42 51.95,36.83 v51.19,36.83 | v200.93,82.55 200.93,82.3 201.56,81.66 204.76,81.66 XC1.P$33 | v170.83,83.19 169.56,84.45 v169.56,93.34 | v27.57,66.29 27.7,66.17 27.7,60.71 24.65,57.66 v24.52,57.66
  Bottom 0.152: U3.19 106.69,78.74 53.99,78.74 52.72,77.47 U1.19 | v51.19,36.83 44.46,36.83 42.05,34.42 29.09,34.42 22.49,41.02 22.49,56.26 23.89,57.66 v24.52,57.66 | v200.93,82.55 200.29,83.19 v170.83,83.19 | v99.07,93.34 v169.56,93.34 | v50.81,67.06 50.48,66.73 40.65,66.73 40.22,66.29 v27.57,66.29
EZ-!RST  (via drill 0.35)
  Top 0.152: U6.15 147.97,56.52 v147.97,59.05 | v82.05,57.4 82.05,57.78 80.02,59.82 74.81,59.82 U9.2
  Bottom 0.152: v147.97,59.05 123.84,59.05 121.86,57.07 119.72,57.07 119.39,57.4 88.12,57.4 87.89,57.18 87.39,57.18 87.16,57.4 v82.05,57.4
GND  (via drill 0.35)  (49 unrouted)
  Top 0.305: U3.14 116.85,63.5 114.95,63.5 114.95,55.88 113.68,54.61 J9.1 113.68,53.98 v113.68,48.39 | J7.22 121.3,11.43 129.55,19.68 129.55,48.55 129.59,48.56 C6.1 130.19,49.53 128.92,50.8 128.92,64.77 129.55,65.41 C5.1 129.42,65.53 128.92,66.04 128.92,68.71 129.42,69.22 129.55,69.22 | J8.1 104.02,53.47 v104.02,48.39 | v197.5,93.34 193.69,89.53 193.69,81.92 U7.10 194.96,80.64 194.96,68.58 C9.- 196.23,66.67 196.23,49.53 194.96,48.26 U8.10 | U8.19 174,55.24 172.1,53.34 172.1,48.26 U8.1 | v152.41,69.85 152.41,65.41 151.78,64.77 U5.7 | U4.11 159.4,88.27 159.4,81.28 U4.10 159.4,80.64 159.4,72.39 R2.2 158.76,71.75 | R1.2 170.19,75.06 171.97,76.83 U7.1 172.1,81.28 172.1,86.36 174,88.27 U7.19 | 129.55,69.22 131.46,69.22 v132.09,69.85 | U9.1 71.89,60.96 71.89,68.07 v74.31,70.48 73.04,71.75 73.04,87 U2.1 66.69,93.34 66.69,97.16 C2.2 | JP1.1 JP1.2 | v19.44,35.56 15.25,39.75 15.25,62.23 | 15.25,62.23 18.53,62.23 18.5,62.2 19.14,61.57 J2.P$1 | J1.P$1 18.88,94.77 17.18,94.77 15.25,92.84 15.25,62.23 | J4.1 47,105.41 47,106.05 46.37,106.68 30.62,106.68 18.79,94.86 J1.P$1 | 20.33,93.98 J1.P$1 | v128.92,97.79 128.92,83.82 130.19,82.55 C4.1 129.55,81.92 128.92,81.28 128.92,69.85 129.55,69.22
  Bottom 0.305: v104.02,48.39 v113.68,48.39 129.42,48.39 C6.1 | U7.10 195.02,81.53 204.78,81.53 XC1.P$34 | v197.5,93.34 198.39,94.23 204.78,94.23 XC1.P$44 | C8.1 167.65,48.26 171.46,48.26 U8.1 | C8.1 166.51,48.64 160.92,48.64 160.03,47.75 U6.10 J3.3 | R2.2 158.76,71.75 154.32,71.75 v152.41,69.85 v132.09,69.85 | U7.1 171.46,81.28 167.65,81.28 C7.1 166.38,81.92 160.03,81.92 159.4,81.28 U4.10 | U8.10 194.32,47.62 192.42,45.72 189.24,45.72 188.61,46.35 188.61,49.53 167.02,49.53 C8.1 | U1.14 63.26,61.21 71.62,61.21 U9.1 | v74.31,70.48 77.48,70.48 78.75,71.75 C3.1 | J4.1 56.53,96.52 65.42,96.52 66.05,97.16 C2.2 66.69,97.79 67.19,98.3 111.77,98.3 113.55,100.08 | J4.20 33.03,93.98 20.33,93.98 J1.P$1 | C1.1 24.65,64.9 21.32,61.57 J2.P$1 | U2.24 113.55,100.08 | v128.92,97.79 128.47,98.23 115.39,98.23 113.55,100.08 | 42.68,30.97 JP1.2 | JP3.7 117.61,18.29 121.17,14.73 J7.22 | JP1.1 21.47,33.53 v19.44,35.56
  other vias: 17.79,12.7 26.68,98.81 8.9,24.13 5.09,97.79 16.52,107.95 30.24,109.6 40.91,109.73 57.16,107.95 66.94,107.95 80.78,107.82 87.39,109.47 96.02,107.06 113.8,109.09 126.76,108.46 124.85,104.01 132.6,101.98 151.9,96.65 161.56,96.52 174.26,96.27 162.95,81.15 191.27,96.01 194.32,59.82 199.53,54.86 199.53,49.66 191.02,40.39 175.14,40.39 129.81,12.32 118.5,24.38 115.84,5.59 104.66,22.23 89.67,4.83 54.62,8.89 31.76,7.62 12.71,48.26 6.36,64.77 11.44,81.28 36.59,72.01 37.6,41.78 79.89,53.34 72.02,76.58 63,87 75.07,28.19 82.69,23.5 184.29,63.5 165.62,61.59 159.02,67.18 166.89,75.06 177.94,63.5
  pour Top: 26.68,48.26 35.57,48.26 38.11,45.72 47,45.72 48.27,46.99 76.21,46.99 79.01,49.78 79.01,57.15 44.46,57.15 43.19,58.42 36.84,58.42 35.57,57.15 31.76,57.15 26.68,52.07
  pour Top: 0.01,112.52 134.63,112.52 134.63,98.81 200.67,98.81 200.67,36.07 135.01,36.07 135.01,0 0.01,0
  pour Bottom: 0.01,112.52 134.63,112.52 134.63,98.81 200.67,98.81 200.67,36.07 134.89,36.07 134.89,0 0.01,0
IN-A00  (via drill 0.35)
  Top 0.152: U7.17 179.59,83.19 180.99,81.79 v180.99,69.85 | v199.91,69.72 200.75,68.89 XC1.P$23
  Bottom 0.152: v180.99,69.85 181.62,70.48 199.15,70.48 v199.91,69.72
IN-A01  (via drill 0.35)
  Top 0.152: U7.4 180.35,80.01 v180.35,73.03 | v199.4,72.39 199.15,72.14 199.15,67.82 200.67,66.29 204.79,66.29 XC1.P$21
  Bottom 0.152: v180.35,73.03 180.99,72.39 v199.4,72.39
IN-A02  (via drill 0.35)
  Top 0.152: v195.59,90.17 198.77,87 198.77,66.04 200.93,63.88 204.76,63.88 XC1.P$19
  Bottom 0.152: v195.59,90.17 186.07,90.17 184.8,88.9 U7.15
IN-A03  (via drill 0.35)
  Top 0.152: U7.6 190.51,74.93 v190.51,62.87 | v199.91,62.87 201.51,61.27 XC1.P$17
  Bottom 0.152: v199.91,62.87 v190.51,62.87
IN-A04  (via drill 0.35)
  Top 0.152: U7.13 189.75,83.06 191.15,81.66 v191.15,64.77 | v198.77,64.14 198.77,60.45 200.42,58.8 204.76,58.8 XC1.P$15
  Bottom 0.152: v191.15,64.77 191.78,64.14 v198.77,64.14
IN-A05  (via drill 0.35)
  Top 0.152: v198.13,82.55 198.13,58.29 200.29,56.13 204.79,56.13 XC1.P$13
  Bottom 0.152: v198.13,82.55 191.15,82.55 189.88,81.28 U7.8
IN-A06  (via drill 0.35)
  Top 0.152: v194.96,53.34 189.88,48.26 U8.8
  Bottom 0.152: v194.96,53.34 195.21,53.59 204.78,53.59 XC1.P$12
IN-A07
  Bottom 0.152: U8.13 189.88,55.88 191.15,57.15 195.39,57.15 196.43,56.19 XC1.P$14
IN-A08  (via drill 0.35)
  Top 0.152: v186.07,57.15 186.07,49.53 184.8,48.26 U8.6
  Bottom 0.152: v186.07,57.15 187.59,58.67 204.78,58.67 XC1.P$16
IN-A09  (via drill 0.35)
  Top 0.152: v185.43,60.96 185.43,56.52 184.8,55.88 U8.15
  Bottom 0.152: v185.43,60.96 185.69,61.21 204.78,61.21 XC1.P$18
IN-A10  (via drill 0.35)
  Top 0.152: v183.53,60.96 183.53,52.07 179.72,48.26 U8.4
  Bottom 0.152: v183.53,60.96 186.07,63.5 200.67,63.5 201.05,63.88 204.76,63.88 XC1.P$20
IN-A11  (via drill 0.35)
  Top 0.152: v179.72,60.96 179.72,55.88 U8.17
  Bottom 0.152: v179.72,60.96 184.42,65.66 195.7,65.66 196.5,66.34 XC1.P$22
IN-A12  (via drill 0.35)
  Top 0.152: v178.45,60.96 178.45,52.07 174.64,48.26 U8.2
  Bottom 0.152: v178.45,60.96 183.53,66.04 195.59,66.04 198.39,68.83 198.43,68.83 198.49,68.89 XC1.P$24
IN-A13  (via drill 0.35)
  Top 0.152: v177.18,83.82 174.64,81.28 U7.2
  Bottom 0.152: v177.18,83.82 197.14,83.82 197.49,84.12 XC1.P$36
IN-A14
  Bottom 0.152: U8.11 194.32,55.24 193.05,53.98 193.05,52.45 194.45,51.05 204.79,51.05 XC1.P$10
IN-A15
  Top 0.152: U7.11 197.5,85.72 197.5,54.48 200.93,51.05 204.79,51.05 XC1.P$9
N$1  (via drill 0.35)
  Top 0.152: U6.11 160.29,54.36 160.29,46.22 v156.74,42.67
  Bottom 0.152: J3.2 v156.74,42.67
N$2
  Bottom 0.152: U1.1 32.27,59.18 J5.2
N$5
  Top 0.152: R3.1 162.57,61.59 162.57,66.04 162.57,66.8 163.84,68.07 | R1.1 162.57,74.93 162.57,69.34 163.84,68.07 | Q1.B 163.84,68.07
N$52  (via drill 0.35)
  Top 0.152: SJ4.2 174.89,74.55 175.65,74.55 176.03,74.17 176.03,72.26 174.76,70.99 v174.26,70.99 | v170.06,65.79 166.64,65.79 Q1.C
  Bottom 0.152: v174.26,70.99 170.06,66.8 v170.06,65.79
N$63
  Bottom 0.152: U5.2 139.08,64.77 140.35,66.04 147.33,66.04 148.6,64.77 U5.6
N$89  (via drill 0.35)
  Top 0.152: v146.06,61.59 146.06,64.14 U5.5 | v123.2,61.59 123.2,97.79 U2.22
  Bottom 0.152: v123.2,61.59 v146.06,61.59
R-SP01  (via drill 0.35)
  Top 0.152: v131.46,40.01 137.81,46.35 137.81,52.07 140.98,55.24 U6.18
  Bottom 0.152: v131.46,40.01 122.57,40.01 121.93,40.64 102.25,40.64 100.98,39.37 J6.9
RAM-!CE  (via drill 0.35)
  Top 0.152: v140.35,94.61 145.43,89.53 145.43,57.15 144.16,55.88 U6.17 | v58.43,94.61 55.26,94.61 55.26,82.55 50.18,77.47 U1.20
  Bottom 0.152: v58.43,94.61 v140.35,94.61
RAM-A14  (via drill 0.35)
  Top 0.152: v132.73,47.62 138.44,53.34 138.44,55.24 U6.19 | U1.10 50.1,59.24 38.95,59.24 38.72,59.46 36.23,59.46 34.89,58.12 30.69,58.12 25.91,53.33 25.91,51.88 24.52,50.5 24.52,45.09 30.11,39.5 v52.46,39.5
  Bottom 0.152: v132.73,47.62 85.1,47.62 78.5,41.02 67.32,41.02 66.31,40.01 64.15,40.01 61.35,42.8 57.03,42.8 56.15,41.91 54.49,41.91 52.46,39.88 v52.46,39.5
ROM-!CE  (via drill 0.35)
  Top 0.152: v151.14,61.59 151.14,55.88 U6.14 | v101.61,63.5 100.98,64.14 100.98,76.83 U3.22 100.98,77.47 102.25,78.74 104.15,78.74 U3.20
  Bottom 0.152: v151.14,61.59 150.51,62.23 120.66,62.23 119.39,63.5 v101.61,63.5
ROM-A14  (via drill 0.35)
  Top 0.152: v87.01,55.63 87.01,76.2 87.64,76.83 U3.27
  Bottom 0.152: v87.01,55.63 87.51,55.12 102.12,55.12 102.88,55.88 104.15,55.88 J8.2
ROM-A15  (via drill 0.35)
  Top 0.152: U3.1 86.37,60.96 v86.37,58.42 | v116.22,58.42 116.22,54.61 J9.2
  Bottom 0.152: v116.22,58.42 97.04,58.42 96.28,59.18 89.47,59.18 88.71,58.42 v86.37,58.42
SND  (via drill 0.35)
  Top 0.152: SJ4.1 174.26,72.9 v171.84,72.9 | v161.3,47.88 v161.3,71.37 | v148.98,43.31 145.05,39.37 v144.28,39.37
  Bottom 0.152: J6.21 70.5,38.73 70.5,36.2 71.13,35.56 128.92,35.56 131.46,38.1 140.98,38.1 142.25,39.37 v144.28,39.37 146.32,37.34 162.95,37.34 167.27,41.66 197.04,41.66 197.8,40.95 XC1.P$2 | v171.84,72.9 171.66,72.72 162.65,72.72 v161.3,71.37 | v161.3,47.88 161.3,46.6 160.17,45.47 151.14,45.47 v148.98,43.31
VCC  (via drill 0.35)
  Top 0.305: U8.20 171.46,55.88 171.46,59.69 170.19,60.96 R3.2 174,65.41 174,67.94 C9.+ 168.92,73.66 168.92,85.09 C7.2 | v200.54,70.74 201.18,71.37 204.78,71.37 XC1.P$25 | 110.5,104.14 104.79,104.14 103.52,102.87 U2.28 | 110.5,104.14 110.5,102.87 U2.25 | 136.54,64.14 138.44,66.04 142.25,66.04 143.52,64.77 U5.4 | 136.54,64.14 136.54,55.88 U6.20 | 136.54,64.14 U5.1 136.54,64.77 136.54,71.75 U5.14 135.9,72.39 135.27,73.03 135.27,87.63 135.9,88.27 U4.20 | 110.5,104.14 112.41,106.05 125.11,106.05 130.19,100.97 130.19,87.63 C4.2 | v35.57,92.08 35.57,83.19 29.86,77.47 U1.28 | U9.3 75.45,60.98 75.45,73.53 78.75,76.83 C3.2 79.39,77.47 74.31,82.55 74.31,88.27 73.67,88.9 73.67,101.6 U2.40 72.4,102.87 66.69,102.87 C2.1 66.05,102.23 65.42,101.6 65.42,93.34 67.32,91.44 67.32,62.74 71.06,59 79.61,59 80.91,57.7 80.91,56.9 82.69,55.12 82.69,49.91 75.58,42.8 70.12,42.8 67.83,40.51 J6.22 | v44.46,101.35 44.46,97.16 43.83,96.52 J4.11 | v57.16,29.84 v57.16,15.75 | JP1.3 39.76,28.45 34.81,33.4 v34.81,35.69 | C8.2 166.89,54.07 164.98,52.16 v164.98,48.39
  Bottom 0.305: C8.2 167.02,54.61 167.65,55.24 171.46,55.24 U8.20 | C7.2 167.02,87.63 167.65,88.27 171.46,88.27 U7.20 | v200.54,70.74 200.04,71.25 177.3,71.25 174.64,68.58 C9.+ | J8.3 110.5,52.07 116.85,52.07 118.76,53.98 | C4.2 130.19,87.63 130.82,88.27 135.9,88.27 U4.20 | U6.20 135.9,55.24 130.82,55.24 130.19,54.61 C6.2 129.55,53.98 118.76,53.98 | C5.2 130.19,71.12 130.82,71.75 135.9,71.75 U5.14 | 118.76,53.98 J9.3 | R3.2 169.56,61.59 168.29,62.87 160.03,62.87 159.4,62.23 156.22,62.23 151.78,66.67 139.08,66.67 137.17,64.77 136.54,64.77 U5.1 | J6.22 67.32,38.73 58.43,29.84 v57.16,29.84 45.1,29.84 43.83,28.57 43.19,28.57 JP1.3 | U1.28 C1.2 | J4.11 J4.10 45.73,93.34 44.46,92.08 v35.57,92.08 | C3.2 79.39,76.83 85.1,76.83 U3.28 | C2.1 66.05,102.23 45.35,102.23 v44.46,101.35 43.57,102.23 41.92,102.23 40.65,100.97 40.65,100.33 41.92,99.06 109.23,99.06 110.5,100.33 110.5,102.23 U2.25 | JP3.8 v57.16,15.75 | v34.81,35.69 J5.1 | J3.1 v164.98,48.39
Φ  (via drill 0.35)
  Top 0.152: v88.91,46.35 88.28,45.72 88.28,39.37 J6.14 | U5.3 140.98,64.14 137.81,60.96 137.81,53.98 131.46,47.62 v131.46,46.35 v132.73,45.09 | v195.59,45.09 v197.5,46.99
  Bottom 0.152: v88.91,46.35 v131.46,46.35 | v197.5,46.99 197.54,46.99 199.11,48.56 XC1.P$8 | v132.73,45.09 143.78,45.09 148.73,40.13 160.79,40.13 165.75,45.09 v195.59,45.09
(copper drawn outside any net)
  shapes: Top area x4

## Text on the board
tPlace: ABC MIX to AMP | AY-3-8910 I/O Headers | A | B | C | AY CHANNELS | IOA0 | IOA2 | IOA4 | IOA6 | +5v | IOB7 | IOB5 | IOB3 | IOB1 | GND | 19 | 17 | 15 | 13 | 11 | 9 | 7 | 5 | 3 | 1 | Socket optional | PSG | AY LOGIC | ADDR BUFFER | 20 | 18 | 16 | 14 | 12 | 10 | 8 | 6 | 4 | 2 | GND | IOA1 | IOA3 | IOA5 | IOA7 | +5v | IOB6 | IOB4 | IOB2 | IOB0 | PSG CONTROL PORT B | NO SOCKET! | SOCKET! | CLOCK DIV. | Amp to SND | 5V BALANCER | E | RAM / RTC | SOCKET! | ROM | SOCKET! | No socket | B | Amplifier | DS1244-Y | C | RESET | RAM/ROM/USB LOGIC | ADDR BUFFER | HI | HI | PSG CONTROL PORT A | ROM-A14 | ROM-A15 | SOCKET! | NO SOCKET! | LO | LO | v1-6-0, Rev A / 15 MAY 2023 / by Sean Harrington, sph@1stage.com | Reset | Normal | Menu | ROM | Type B / 1 Jumper | 44 | 43 | 42 | 41 | 40 | 39 | 38 | 37 | 36 | 35 | 34 | 33 | 32 | 31 | 30 | 29 | 28 | 27 | 26 | 25 | 24 | 23 | D0-D7 | GND | A0 | +5v | SND | !HALT | !WAIT | !M1 | !INT | !NMI | !CSYNC | Φ | A-SP04 | A-SP03 | A-SP02 | A-SP01 | R-SP01 | DE07 | DE06 | DE05 | DE04 | DE03 | DE02 | DE01 | DE00 | CH376S USB Module / Top Side Faces Down | GND | RD | VCC/5V | WR | INT | RST | EXPANSION PORT | A0 | INT | Type A USB modules have 2 jumpers, / LED is near the header row, / and the DATA row is at the BACK / Insert it in the LEFT two pin columns / / Type B USB modules have 1 jumper, / LED is near the USB port and jumper, / and the DATA row is at the MIDDLE / Insert it in the RIGHT two pin columns | CS | CS | RD | GND | WR | VCC/5V | A00 | A01 | A02 | A03 | A04 | A05 | A06 | A07 | A08 | A09 | A10 | A11 | A12 | A13 | A14 | A15 | !RD | !WR | !IORQ | !MREQ | !MRST | GND | D0-D7 | 1 | 2 | 3 | 4 | 5 | 6 | 7 | 8 | 9 | 10 | 11 | 12 | 13 | 14 | 15 | 16 | 17 | 18 | 19 | 20 | 21 | 22 | Type A / 2 Jumpers | Special thanks / to Mack Wharton, / Matt Pilz, & David Roper | Based on Bruce Abbott's Micro Expander / 12 JUN 2017 - bruce.abbott@xtra.co.nz